# EAGLE schematic STRAIGT_SENSOR_NOMUX_16 (EAGLE 6.4)
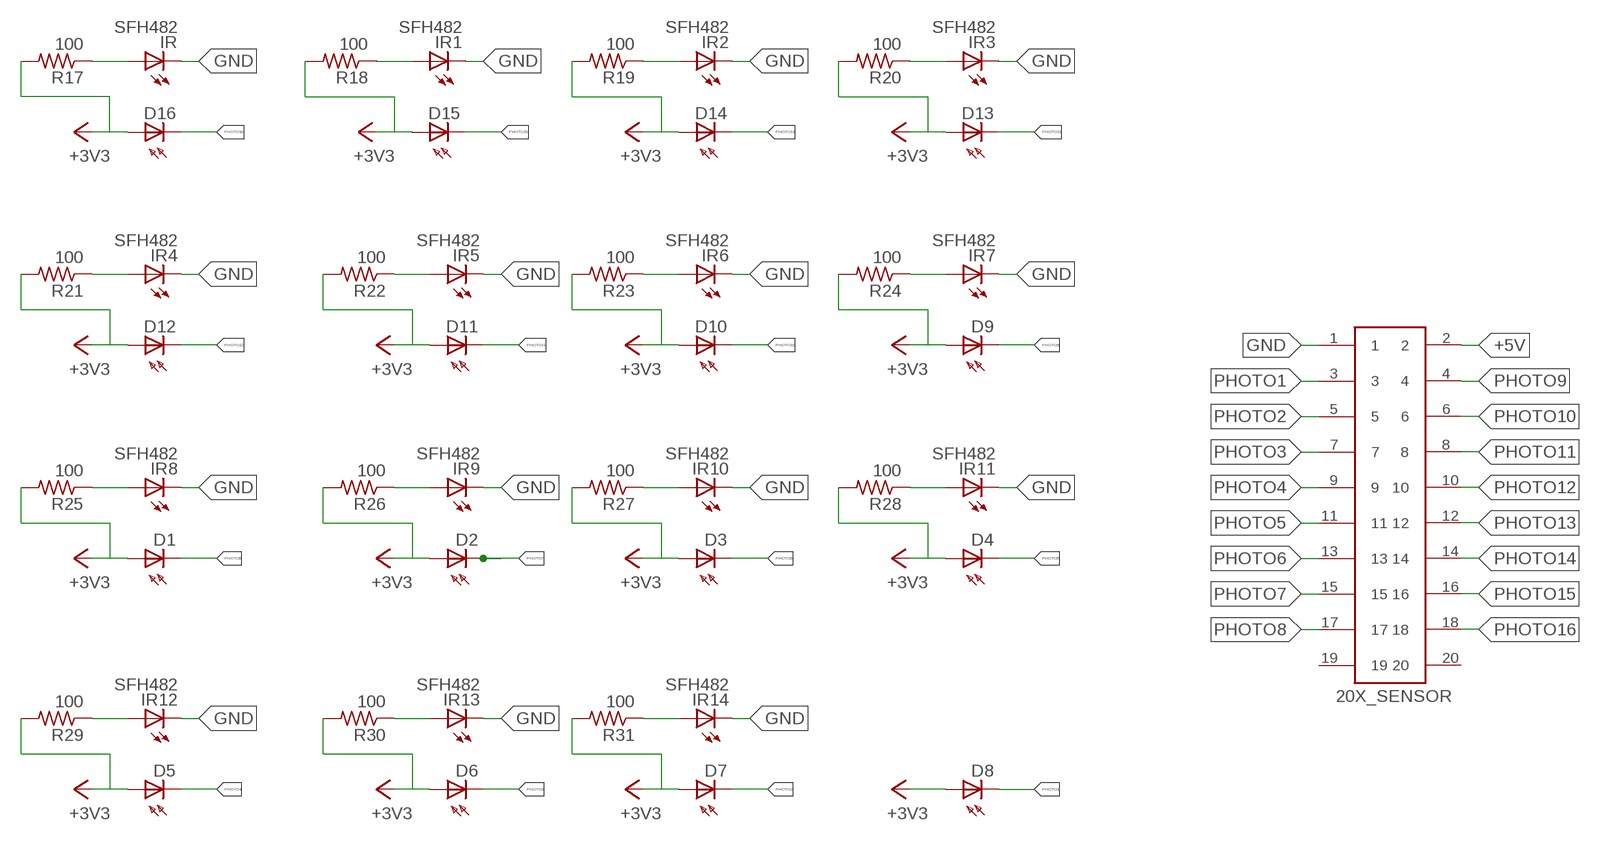
[diagram p0: schematic, sheet 1]

## Parts
20X_SENSOR  61202022021  [61202022021]
D1  Photo0  BPX65  [BPX65]
D2  Photo1  BPX65  [BPX65]
D3  Photo2  BPX65  [BPX65]
D4  Photo3  BPX65  [BPX65]
D5  Photo4  BPX65  [BPX65]
D6  Photo5  BPX65  [BPX65]
D7  Photo6  BPX65  [BPX65]
D8  Photo7  BPX65  [BPX65]
D9  Photo0  BPX65  [BPX65]
D10  Photo0  BPX65  [BPX65]
D11  Photo0  BPX65  [BPX65]
D12  Photo0  BPX65  [BPX65]
D13  Photo0  BPX65  [BPX65]
D14  Photo0  BPX65  [BPX65]
D15  Photo0  BPX65  [BPX65]
D16  Photo0  BPX65  [BPX65]
IR  SFH482  [SFH482]
IR1  SFH482  [SFH482]
IR2  SFH482  [SFH482]
IR3  SFH482  [SFH482]
IR4  SFH482  [SFH482]
IR5  SFH482  [SFH482]
IR6  SFH482  [SFH482]
IR7  SFH482  [SFH482]
IR8  SFH482  [SFH482]
IR9  SFH482  [SFH482]
IR10  SFH482  [SFH482]
IR11  SFH482  [SFH482]
IR12  SFH482  [SFH482]
IR13  SFH482  [SFH482]
IR14  SFH482  [SFH482]
R17  100  R-US_0207/10  [0207/10]
R18  100  R-US_0207/10  [0207/10]
R19  100  R-US_0207/10  [0207/10]
R20  100  R-US_0207/10  [0207/10]
R21  100  R-US_0207/10  [0207/10]
R22  100  R-US_0207/10  [0207/10]
R23  100  R-US_0207/10  [0207/10]
R24  100  R-US_0207/10  [0207/10]
R25  100  R-US_0207/10  [0207/10]
R26  100  R-US_0207/10  [0207/10]
R27  100  R-US_0207/10  [0207/10]
R28  100  R-US_0207/10  [0207/10]
R29  100  R-US_0207/10  [0207/10]
R30  100  R-US_0207/10  [0207/10]
R31  100  R-US_0207/10  [0207/10]

## Nets
+3V3: D1.A D2.A D3.A D4.A D5.A D6.A D7.A D8.A D9.A D10.A D11.A D12.A D13.A D14.A D15.A D16.A R17.2 R18.2 R19.2 R20.2 R21.2 R22.2 R23.2 R24.2 R25.2 R26.2 R27.2 R28.2 R29.2 R30.2 R31.2
+5V: 20X_SENSOR.2
GND: 20X_SENSOR.1 IR1.K(C) IR2.K(C) IR3.K(C) IR4.K(C) IR5.K(C) IR6.K(C) IR7.K(C) IR8.K(C) IR9.K(C) IR10.K(C) IR11.K(C) IR12.K(C) IR13.K(C) IR14.K(C) IR.K(C)
N$1: IR1.A R18.1
N$2: IR.A R17.1
N$3: IR2.A R19.1
N$4: IR3.A R20.1
N$5: IR4.A R21.1
N$6: IR5.A R22.1
N$7: IR6.A R23.1
N$8: IR7.A R24.1
N$9: IR8.A R25.1
N$10: IR9.A R26.1
N$11: IR10.A R27.1
N$12: IR11.A R28.1
N$13: IR12.A R29.1
N$14: IR13.A R30.1
N$15: IR14.A R31.1
PHOTO1: 20X_SENSOR.3 D8.K(C)
PHOTO2: 20X_SENSOR.5 D7.K(C)
PHOTO3: 20X_SENSOR.7 D6.K(C)
PHOTO4: 20X_SENSOR.9 D5.K(C)
PHOTO5: 20X_SENSOR.11 D4.K(C)
PHOTO6: 20X_SENSOR.13 D3.K(C)
PHOTO7: 20X_SENSOR.15 D2.K(C)
PHOTO8: 20X_SENSOR.17 D1.K(C)
PHOTO9: 20X_SENSOR.4 D9.K(C)
PHOTO10: 20X_SENSOR.6 D10.K(C)
PHOTO11: 20X_SENSOR.8 D11.K(C)
PHOTO12: 20X_SENSOR.10 D12.K(C)
PHOTO13: 20X_SENSOR.12 D13.K(C)
PHOTO14: 20X_SENSOR.14 D14.K(C)
PHOTO15: 20X_SENSOR.16 D15.K(C)
PHOTO16: 20X_SENSOR.18 D16.K(C)
Unconnected: 20X_SENSOR.19 20X_SENSOR.20

## Library data of the parts
20X_SENSOR = Wuerth_Elektronik_eiCan_05_Box_Header_IDC_Connectors_1_2:61202022021: WR-BHD 2.54mm Male Box Header With Lever, 20 Pins
D1-D16 = opto-trans-siemens:BPX65: PHOTO DIODE; MPN: BPX65.; OC_FARNELL: 327451; OC_NEWARK: 06WX2764
IR IR1-IR14 = led:SFH482: IR LED infrared emitting diode, Infineon
R17-R31 = resistor:R-US_: RESISTOR, American symbol